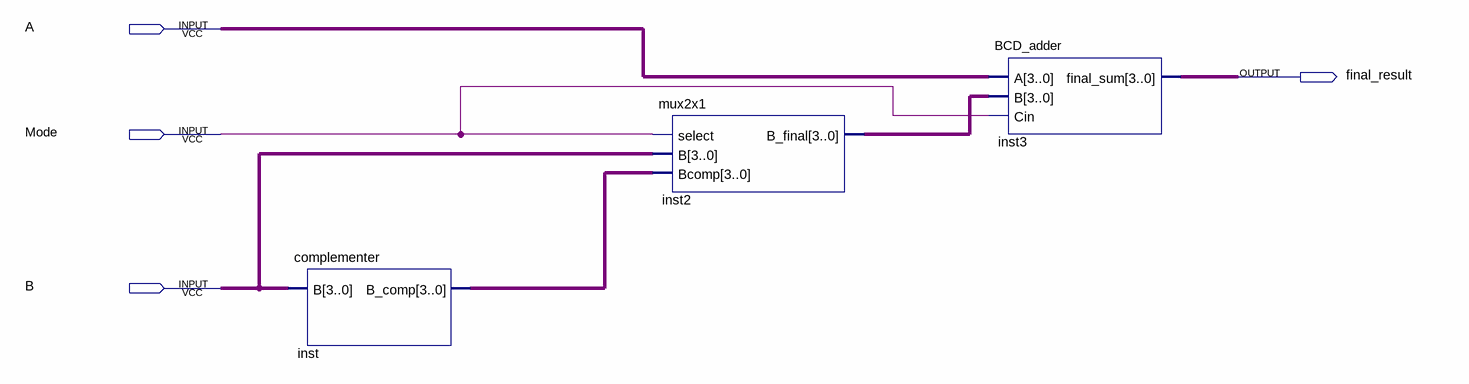
[diagram p0: schematic sheet]
// Quartus schematic BCD_adder_subber_parts.bdf as structural Verilog: 3 symbols, 4 pins
module BCD_adder_subber_parts (
  input  A,
  input  Mode,
  input  B,
  output final_result
);

  wire [3:0] inst2_b_final, inst3_final_sum, inst_b_comp, undriven, undriven_2;

  complementer inst (.B(undriven_2), .B_comp(inst_b_comp));
  mux2x1 inst2 (.select(Mode), .B(undriven_2), .Bcomp(inst_b_comp), .B_final(inst2_b_final));
  BCD_adder inst3 (.A(undriven), .B(inst2_b_final), .Cin(Mode), .final_sum(inst3_final_sum));
endmodule
